# EAGLE design lm2596 current limited charger (EAGLE 9.4.2)
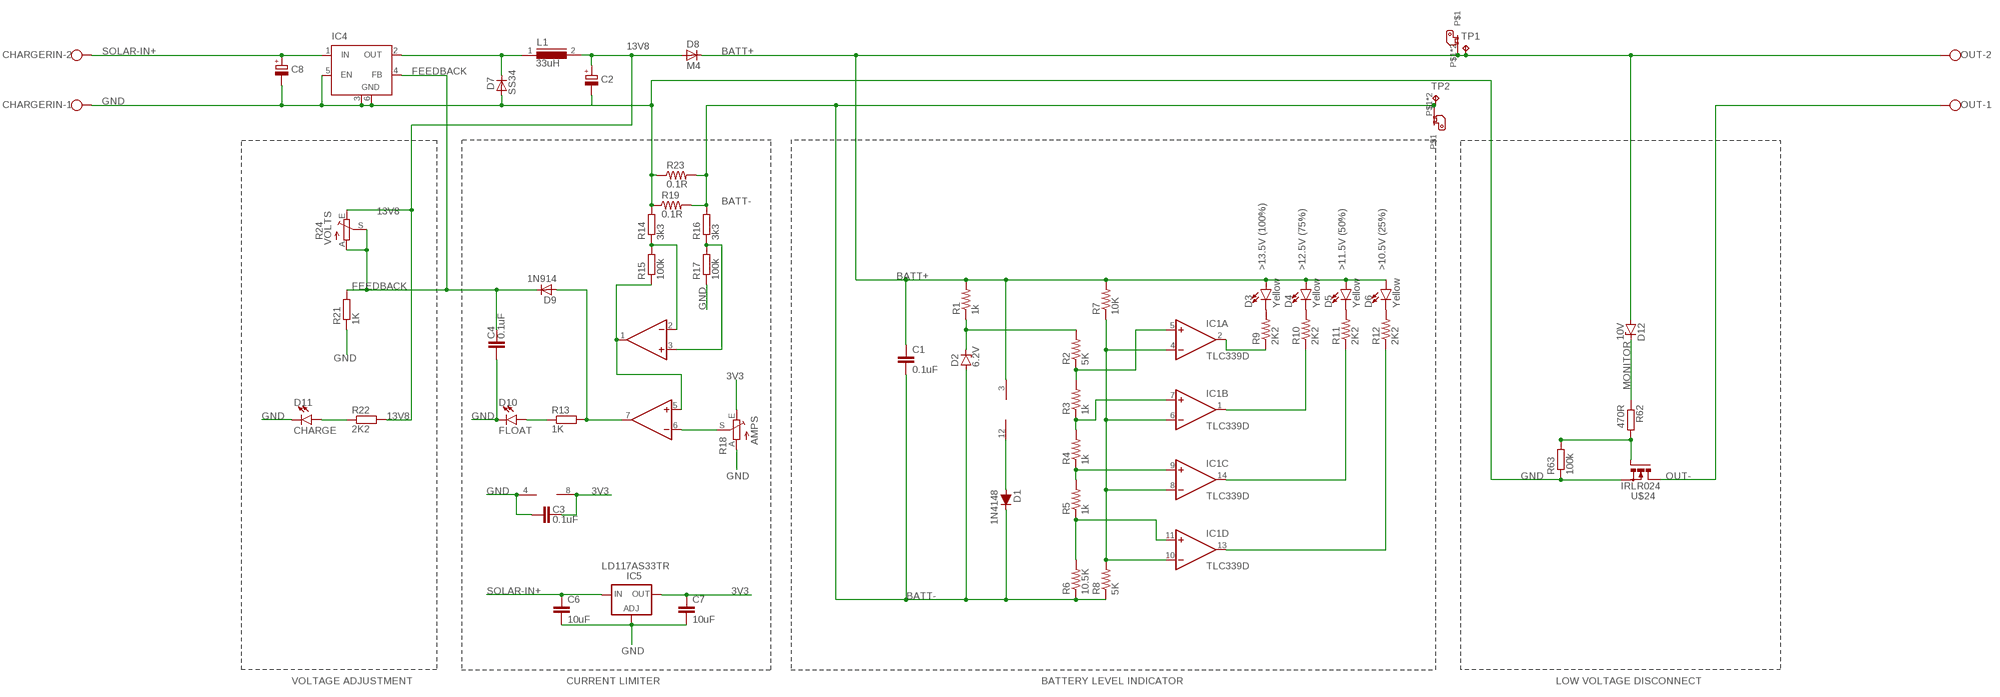
[diagram p0: schematic, sheet 1]

## Parts
C1  0.1uF  C-EUC1206K  [C1206K]
C2  CPOL-EUE3.5-8  [E3,5-8]
C3  0.1uF  C-EUC1206K  [C1206K]
C4  0.1uF  C-EUC1206K  [C1206K]
C6  10uF  C-EUC1206K  [C1206K]
C7  10uF  C-EUC1206K  [C1206K]
C8  CPOL-EUE3.5-8  [E3,5-8]
CHARGERIN  W237-102  [W237-102]
D1  1N4148  DIODE-BAS16J  [SOD-323]
D2  6.2V  ZENER-DIODESMB  [SMB]
D3  Yellow  LED-YELLOWLILYPAD  [LED-1206]
D4  Yellow  LED-YELLOWLILYPAD  [LED-1206]
D5  Yellow  LED-YELLOWLILYPAD  [LED-1206]
D6  Yellow  LED-YELLOWLILYPAD  [LED-1206]
D7  SS34  D-SOD-87  [SOD87]
D8  M4  D-SOD-87  [SOD87]
D9  1N914  D-SOD-87  [SOD87]
D10  FLOAT  LED-YELLOWLILYPAD  [LED-1206]
D11  CHARGE  LED-YELLOWLILYPAD  [LED-1206]
D12  10V  ZENER-DIODESMB  [SMB]
IC1  TLC339D  [SO14]
IC2  MCP602SN  [SO08]
IC4  LM2596S  [TO263-5]
IC5  LD117AS33TR  [SOT223]
L1  33uH  DR127  [DR127]
OUT  W237-102  [W237-102]
R1  1k  R-US_R1206  [R1206]
R2  5K  R-US_R1206  [R1206]
R3  1k  R-US_R1206  [R1206]
R4  1k  R-US_R1206  [R1206]
R5  1k  R-US_R1206  [R1206]
R6  10.5K  R-US_R1206  [R1206]
R7  10K  R-US_R1206  [R1206]
R8  5K  R-US_R1206  [R1206]
R9  2K2  R-US_R1206  [R1206]
R10  2K2  R-US_R1206  [R1206]
R11  2K2  R-US_R1206  [R1206]
R12  2K2  R-US_R1206  [R1206]
R13  1K  R-EU_R1206  [R1206]
R14  3k3  R-EU_R1206  [R1206]
R15  100k  R-EU_R1206  [R1206]
R16  3k3  R-EU_R1206  [R1206]
R17  100k  R-EU_R1206  [R1206]
R18  AMPS  TRIM_EU-B64Y  [B64Y]
R19  0.1R  R-US_R2512  [R2512]
R21  1K  R-EU_R1206  [R1206]
R22  2K2  R-EU_R1206  [R1206]
R23  0.1R  R-US_R2512  [R2512]
R24  VOLTS  TRIM_EU-B64Y  [B64Y]
R62  470R  R-EU_R0603  [R0603]
R63  100k  R-EU_R0603  [R0603]
TP1  TPPAD1-20Y  [P1-20Y]
TP2  TPPAD1-20Y  [P1-20Y]
U$2  PCB-6.35MM-RA-SPADE  [PCB-6.35MM-RA-SPADE]
U$3  PCB-6.35MM-RA-SPADE  [PCB-6.35MM-RA-SPADE]
U$24  IRLR024  N-POWER-MOSFETDPAK-MOSFET  [D-PAK_TO252AA]

## Nets
3V3: C3.2 C7.1 IC2.8(P:V+) IC5.4(OUT) R18.E
13V8: C2.+ D8.2(A) L1.2 R22.2 R24.E
BATT+: C1.1 D3.A D4.A D5.A D6.A D8.1(C) D12.A IC1.3(P:V+) OUT.2 R1.2 R7.2 TP1.TP U$2.P$1 U$2.P$2
BATT-: C1.2 D1.C D2.A R6.1 R8.1 R16.2 R19.2 R23.2 TP2.TP U$3.P$1 U$3.P$2
FEEDBACK: C4.2 D9.1(C) IC4.4(FB) R21.2 R24.A R24.S
GND: C2.- C3.1 C4.1 C6.2 C7.2 C8.- CHARGERIN.1 D7.2(A) D10.C D11.C IC2.4(P:V-) IC4.3(GND) IC4.5(EN) IC4.6(GND) IC5.1(ADJ) R14.2 R17.1 R18.A R19.1 R21.1 R23.1 R63.1 U$24.3(S)
MONITOR: D12.C R62.1
N$1: D7.1(C) IC4.2(OUT) L1.1
N$2: D2.C R1.1 R2.2
N$3: IC1.5(A:+IN) R2.1 R3.2
N$4: IC1.7(B:+IN) R3.1 R4.2
N$5: IC1.9(C:+IN) R4.1 R5.2
N$6: IC1.11(D:+IN) R5.1 R6.2
N$7: IC1.4(A:-IN) IC1.6(B:-IN) IC1.8(C:-IN) IC1.10(D:-IN) R7.1 R8.2
N$8: D3.C R9.2
N$9: D4.C R10.2
N$10: D5.C R11.2
N$11: D6.C R12.2
N$12: R62.2 R63.2 U$24.1(G)
N$13: IC1.2(A:OUT) R9.1
N$14: IC1.1(B:OUT) R10.1
N$15: IC1.14(C:OUT) R11.1
N$16: IC1.13(D:OUT) R12.1
N$17: D1.A IC1.12(P:V-)
N$18: D9.2(A) IC2.7(B:OUT) R13.2
N$19: IC2.6(B:-IN) R18.S
N$20: D10.A R13.1
N$21: IC2.1(A:OUT) IC2.5(B:+IN) R15.1
N$22: D11.A R22.1
N$23: IC2.3(A:+IN) R16.1 R17.2
N$24: IC2.2(A:-IN) R14.1 R15.2
OUT-: OUT.1 U$24.4(D)
SOLAR-IN+: C6.1 C8.+ CHARGERIN.2 IC4.1(IN) IC5.3(IN)

## Notes on the sheet
- >13.5V (100%) | >12.5V (75%) | >11.5V (50%) | >10.5V (25%)
- VOLTAGE ADJUSTMENT | CURRENT LIMITER | BATTERY LEVEL INDICATOR | LOW VOLTAGE DISCONNECT

## Library data of the parts
C1 C3 C4 C6 C7 = rcl:C-EU: CAPACITOR, European symbol; SPICEPREFIX: C
C2 C8 = resistor:CPOL-EU: POLARIZED CAPACITOR, European symbol
CHARGERIN OUT = con-wago-500:W237-102: WAGO SCREW CLAMP; MPN: 237-102; OC_FARNELL: unknown; OC_NEWARK: 70K9898
D1 = SparkFun-DiscreteSemi:DIODE: Diode These are standard reverse protection diodes and small signal diodes. SparkFun Products: SparkFun SparkPunk Sound Kit <https://www.sparkfun.com/products/11177> SparkFun ESP8266 Thing <https://www.sparkfun.com/products/13231>; PROD_ID: DIO-09646; VALUE: 250mA/100V
D2 D12 = diode:ZENER-DIODE: Z-Diode
D3-D6 = SparkFun-LED:LED-YELLOW: Yellow SMD LED Used in manufacturing several products at SparkFun. Packages: 0603 - SMD 0603 package[Product Link] <http://www.kingbrightusa.com/product.asp?catalog_name=LED&product_id=APT1608SYCK> 0603 -SMART - SMART SMD 0603 package (more efficient/more expensive) [Product Link] <http://www.osram-os.com/osram_os/en/products/product-catalog/led-light-emitting-diodes/smartled-0603/ly-l29k/index.jsp> LilyPad - SMD1206 package[Product Datasheet] <https://www.sparkfun.com/datasheets/DevTools/LilyPad/Q150YUS4.pdf> SparkFun Products: Blynk Board <https://www.sparkfun.com/products/13794> IOIO-OTG <https://www.sparkfun.com/products/13613> XBee Explorer Serial <https://www.sparkfun.com/products/13225>; PROD_ID: DIO-09909
D7-D9 = semicon-smd-ipc:D-: DIODE unfilled
D10 D11 = SparkFun-LED:LED-YELLOW: Yellow SMD LED Used in manufacturing several products at SparkFun. Packages: 0603 - SMD 0603 package[Product Link] <http://www.kingbrightusa.com/product.asp?catalog_name=LED&product_id=APT1608SYCK> 0603 -SMART - SMART SMD 0603 package (more efficient/more expensive) [Product Link] <http://www.osram-os.com/osram_os/en/products/product-catalog/led-light-emitting-diodes/smartled-0603/ly-l29k/index.jsp> LilyPad - SMD1206 package[Product Datasheet] <https://www.sparkfun.com/datasheets/DevTools/LilyPad/Q150YUS4.pdf> SparkFun Products: Blynk Board <https://www.sparkfun.com/products/13794> IOIO-OTG <https://www.sparkfun.com/products/13613> XBee Explorer Serial <https://www.sparkfun.com/products/13225>; PROD_ID: DIO-09909; VALUE: Yellow
IC1 = linear:TLC339: COMPARATOR
IC2 = linear:MCP602: Single Op Amp 2.7V to 6.0V Single Supply CMOS Source: http://ww1.microchip.com/downloads/en/DeviceDoc/21314g.pdf
IC4 = linear:LM2596S: STEP-DOWN VOLTAGE REGULATOR
IC5 = v-reg:LD117A?*: Low drop fixed and adjustable positive voltage regulators 1 A Source: http://www.st.com/stonline/products/literature/ds/7194/ld1117axx.pdf
L1 = inductors:DR127: High Power Density, High Efficiency, Shielded Inductors Source: coiltronics_dr_series.pdf
R1-R12 R19 R23 = rcl:R-US_: RESISTOR, American symbol; SPICEPREFIX: R
R13-R17 R21 R22 = rcl:R-EU_: RESISTOR, European symbol; SPICEPREFIX: R
R18 R24 = pot:TRIM_EU-: POTENTIOMETER
R62 R63 = resistor:R-EU_: RESISTOR, European symbol
TP1 TP2 = testpad:TP: Test pad
U$2 U$3 = AUTOMOTIVERELAYS:PCB-6.35MM-RA-SPADE
U$24 = Cohesion_parts:N-POWER-MOSFET

## Net classes
0 default: width 0.254 mm, clearance 0.152 mm

## Board
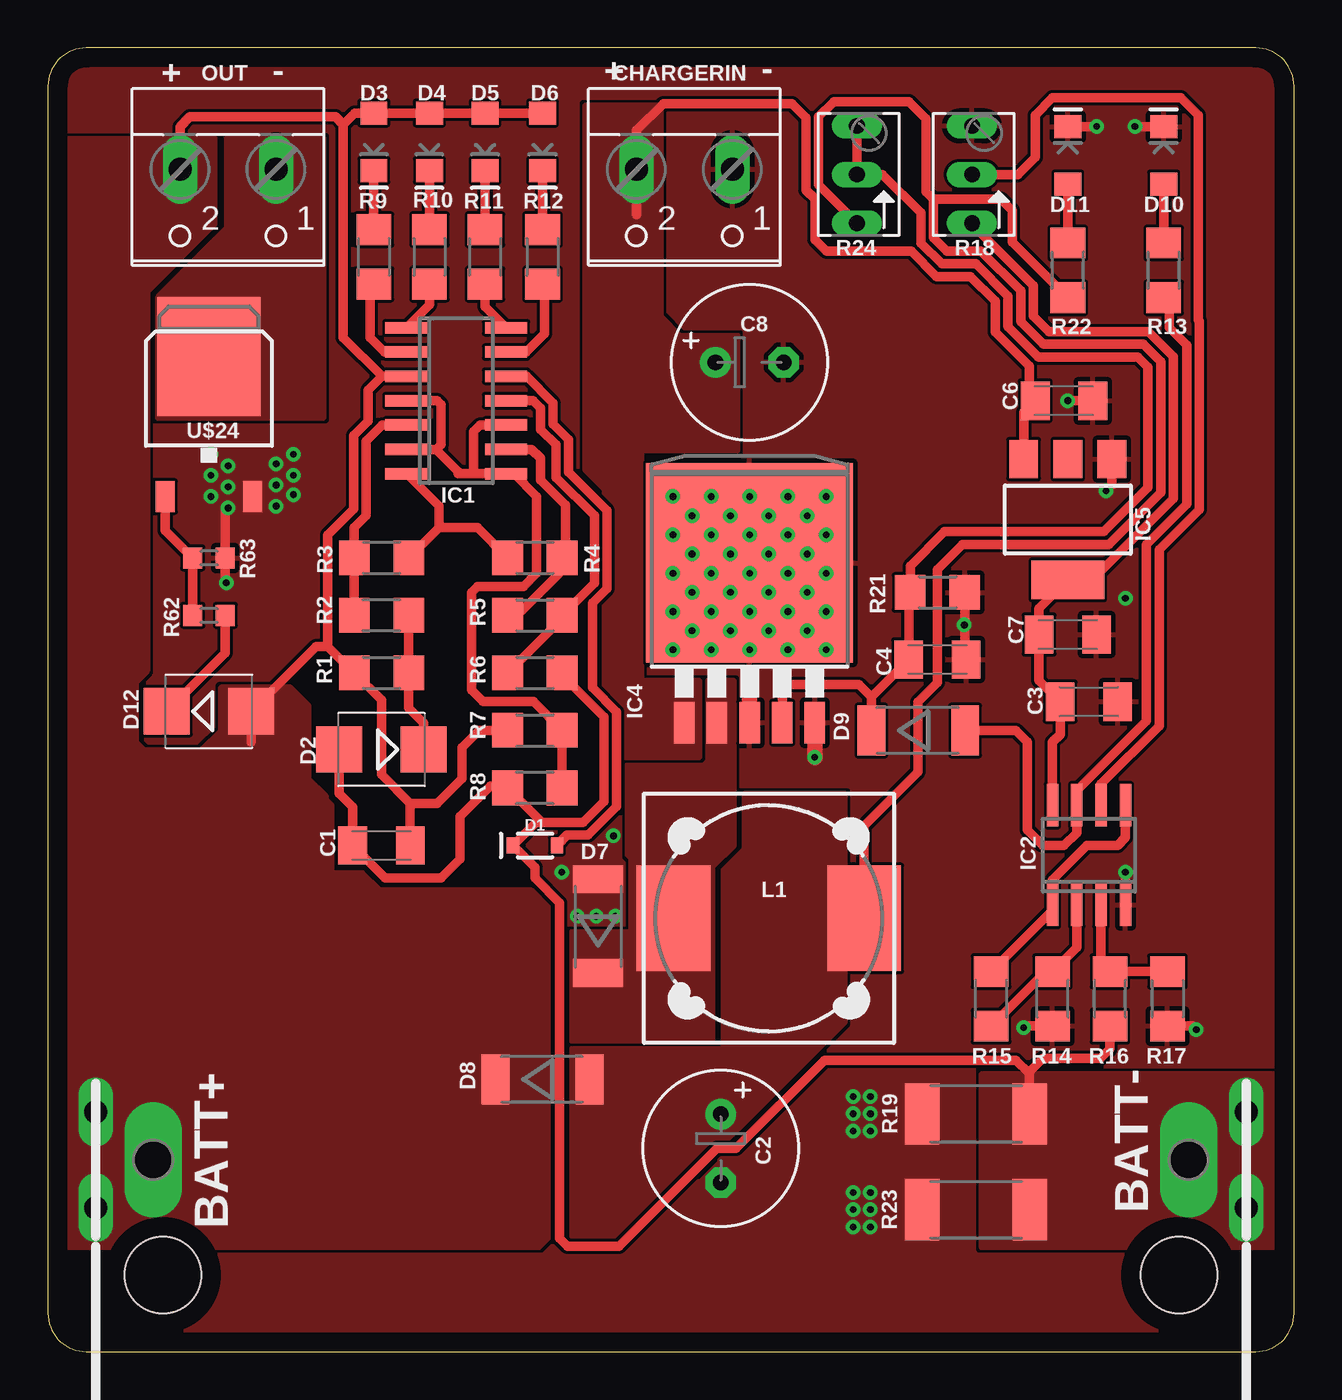
[diagram p1: board, top side]
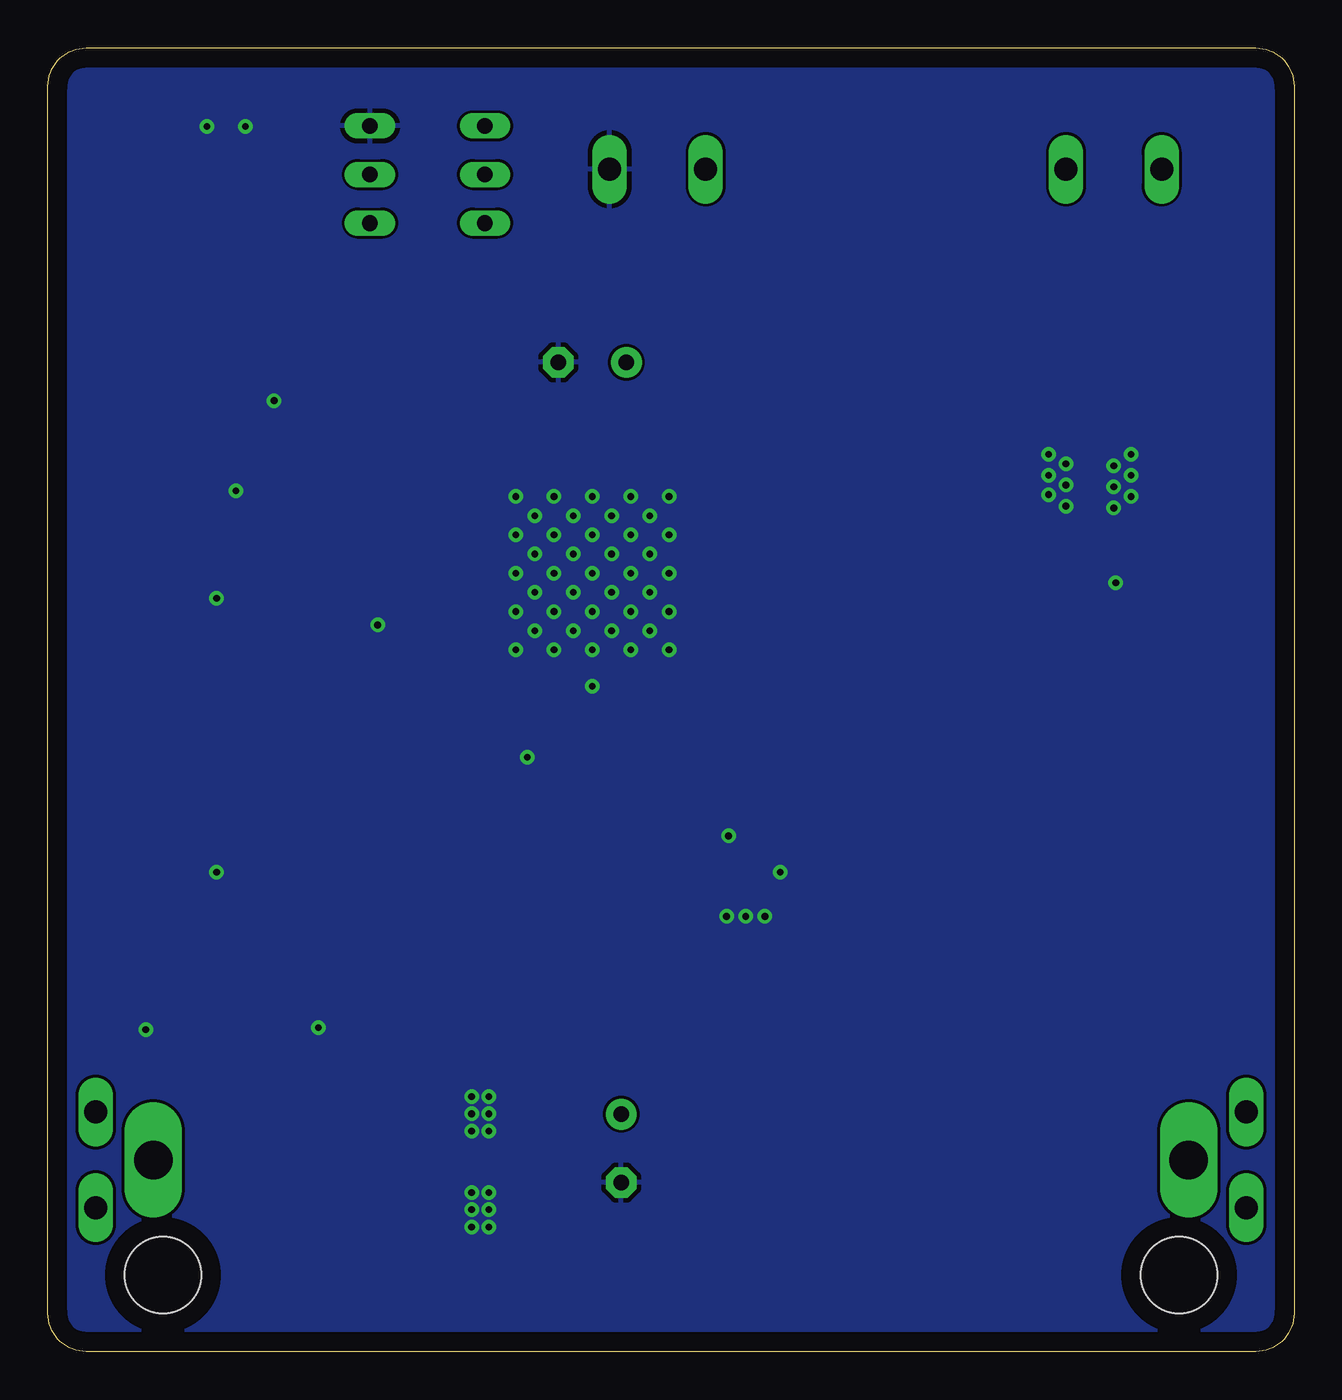
[diagram p2: board, bottom side, seen from below]

Size 65 x 68 mm. Coordinates in mm from the lower left corner, seen from the top.
Outline: 65,2 65,66 arc90 63,68 2,68 arc90 0,66 0,2 arc90 2,0 63,0 arc90 65,2
Copper layers (1*16): Top 0.035mm / dielectric 1.5mm / Bottom 0.035mm
Design rules "default": minimum track width 6mil, minimum drill 0.35mm, track to track 6mil, track to pad 6mil, pad to pad 6mil, via to via 6mil, smd to smd 6mil, copper to edge 40mil, drill to drill 6mil, minimum pad ring 10mil, minimum via ring 8mil, stop-mask expansion 4mil, vias tented up to drill 0mil, thermal gap 10mil
Holes 4 mm at 6,4 59,4

### Footprints (pad centres in the part's own frame; a part is rotated, then mirrored left to right if it is on the bottom)
C1206K = smd 1.5 x 2: 1 -1.5,0; 2 1.5,0
E3,5-8 = drill 0.813 pad 1.6: + -1.778,0 | drill 0.813 pad 1.6 octagon: - 1.778,0
W237-102 = drill 1.194 long: 1 -2.5,-1.27; 2 2.5,-1.27
SOD-323 = smd 0.63 x 0.83: A 1.15,0; C -1.15,0
SMB = smd 2.4 x 2.4: A 2.2,0; C -2.2,0
LED-1206 = smd 1.2 x 1.4: A -1.5,0; C 1.5,0
SOD87 = smd 1.45 x 2.6: 1 -2.445,0; 2 2.445,0
SO14 = smd 0.6 x 2.2: 1 -3.81,-2.6; 2 -2.54,-2.6; 3 -1.27,-2.6; 4 0,-2.6; 5 1.27,-2.6; 6 2.54,-2.6; 7 3.81,-2.6; 8 3.81,2.6; 9 2.54,2.6; 10 1.27,2.6; 11 0,2.6; 12 -1.27,2.6; 13 -2.54,2.6; 14 -3.81,2.6
SO08 = smd 0.6 x 2.2: 1 -1.905,-2.6; 2 -0.635,-2.6; 3 0.635,-2.6; 4 1.905,-2.6; 5 1.905,2.6; 6 0.635,2.6; 7 -0.635,2.6; 8 -1.905,2.6
TO263-5 = smd 1.067 x 2.159: 1 -3.404,-5.791; 2 -1.702,-5.791; 3 0,-5.791; 4 1.702,-5.791; 5 3.404,-5.791 | smd 10.8 x 10.41: 6 0,2.54
SOT223 = smd 1.5 x 2: 1 -2.3,-3.15; 2 0,-3.15; 3 2.3,-3.15 | smd 3.8 x 2: 4 0,3.15
DR127 = smd 3.85 x 5.5: 1 -4.975,0; 2 4.975,0
R1206 = smd 1.6 x 1.803: 1 -1.422,0; 2 1.422,0
B64Y = drill 0.813 long: A 2.54,0; E -2.54,0; S 0,0
R2512 = smd 1.8 x 3.2: 1 -2.8,0; 2 2.8,0
R0603 = smd 1 x 1.1: 1 -0.85,0; 2 0.85,0
P1-20Y = drill 2.007 pad 2.54 long: TP 0,0
PCB-6.35MM-RA-SPADE = drill 1.2 long: P$1 0,2.5; P$2 0,-2.5
D-PAK_TO252AA = smd 1 x 1.6: 1 -2.28,-4.8; 3 2.28,-4.8 | smd 5.4 x 6.2: 4 0,2.5

### Placement (x,y rotation side)
C1  17.4,26.4 180 top
C2  35.1,10.6 270 top
C3  54.3,33.9 180 top
C4  46.4,36.1 180 top
C6  53,49.6 0 top
C7  53.2,37.4 0 top
C8  36.6,51.6 0 top
CHARGERIN  33.2,60.4 180 top
D1  25.4,26.4 0 top
D2  17.4,31.4 180 top
D3  17,63.1 270 top
D4  19.9,63.1 270 top
D5  22.8,63.1 270 top
D6  25.8,63.1 270 top
D7  28.7,22.2 90 top
D8  25.8,14.2 0 top
D9  45.4,32.4 0 top
D10  58.2,62.4 90 top
D11  53.2,62.4 90 top
D12  8.4,33.4 0 top
IC1  21.3,49.6 270 top
IC2  54.3,25.9 0 top
IC4  36.6,38.6 0 top
IC5  53.2,43.4 180 top
L1  37.6,22.6 0 top
OUT  9.4,60.4 180 top
R1  17.4,35.4 180 top
R2  17.4,38.4 0 top
R3  17.4,41.4 180 top
R4  25.4,41.4 180 top
R5  25.4,38.4 180 top
R6  25.4,35.4 180 top
R7  25.4,32.4 180 top
R8  25.4,29.4 0 top
R9  17,57.1 90 top
R10  19.9,57.1 90 top
R11  22.8,57.1 90 top
R12  25.8,57.1 90 top
R13  58.2,56.4 270 top
R14  52.4,18.4 270 top
R15  49.2,18.4 270 top
R16  55.4,18.4 270 top
R17  58.4,18.4 90 top
R18  48.2,61.4 90 top
R19  48.4,12.4 0 top
R21  46.4,39.6 180 top
R22  53.2,56.4 270 top
R23  48.4,7.4 0 top
R24  42.2,61.4 90 top
R62  8.4,38.4 180 top
R63  8.4,41.4 180 top
TP1  5.5,10 180 top
TP2  59.5,10 180 top
U$2  2.5,10 180 top
U$3  62.5,10 180 top
U$24  8.4,49.4 0 top

### Tracks (layer width: path | path; a pad name or v marks a point on that pad's centre or on a via)
3V3
  Top 0.508: IC2.8 52.4,31.8 52.8,32.2 C3.2 51.7,35 C7.1 51.7,38.75 IC5.4 54.45,40.25 58.7,44.5 58.7,51.9 57.4,53.2 52.2,53.2 51.4,54 51.4,55.6 48.2,58.8 R18.E
13V8
  Top 0.508: R22.2 50.3,57.88 50.3,59.5 49.7,60.1 46.2,60.1 | R24.E 40.2,60.86 40.2,64.4 41,65.2 44.9,65.2 45.8,64.3 45.8,60.5 46.2,60.1 | L1.2 42.58,27.42 45.39,30.23 45.39,33.89 46.4,34.9 46.4,40.8 47.7,42.1 55.34,42.1 58.04,44.8 58.04,51.63 57.13,52.54 51.93,52.54 50.74,53.73 50.74,55.33 48.67,57.4 46.9,57.4 46.2,58.1 46.2,60.1
  pour Top (no thermals): 36.3,29.1 36.3,26.2 35.2,25.1 35.2,15.8 27.3,15.8 27.3,6 30.4,6 41.6,17.2 41.6,29.1
BATT+
  Top 0.508: D6.A D5.A D4.A D3.A 16,64.6 15.4,64 | IC1.3 17.43,50.87 | 17.43,50.87 15.4,52.9 15.4,64 | 14.6,36.78 R1.2 17.4,33.98 17.4,30.1 18.9,28.6 | 17.43,50.87 16.7,50.14 16.7,48.53 15.94,47.77 15.94,43.94 14.6,42.6 14.6,36.78 | 18.9,28.6 C1.1 | R7.2 22.5,32.4 21.6,31.5 21.6,29.9 20.3,28.6 18.9,28.6 | OUT.2 6.9,63.9 7.4,64.4 15,64.4 15.4,64 | 14.6,36.78 13.98,36.78 D12.A 10.6,31.8
  pour Top (rank 2, no thermals): 8.7,63.3 8.7,58.8 5.2,55.3 5.2,35.5 4.6,34.9 4.6,31.8 5,31.4 8,31.4 9,32.4 9,34.6 9.1,34.7 12.6,34.7 13.6,33.7 13.6,29.9 14.5,29 14.5,28.8 14.8,28.5 14.8,25 16.4,25 17.3,24.1 25.2,24.1 26.1,23.2 26.1,5.9 25.6,5.4 0.7,5.4 0.3,5.8 0.3,63.3
BATT-
  Top 0.508: D2.A 15.2,29.1 15.9,28.4 C1.2 17.6,24.7 20.5,24.7 21.5,25.7 21.5,27.9 23.1,29.5 23.88,29.5 R8.1 25.78,27.6 | 25.78,27.6 27.9,27.6 29,28.7 29,33.1 26.82,35.28 R6.1 | 25.78,27.6 25.45,27.6 D1.C 25.4,25.25 25.4,24.7 26.7,23.4 26.7,5.9 27.1,5.5 29.8,5.5 34.9,10.6 35.9,10.6 40.5,15.2 50.5,15.2 51.2,14.5 | R19.2 51.2,14.5 | R16.2 55.4,15.8 54.9,15.3 51.9,15.3 51.2,14.6 51.2,14.5
  pour Top (rank 2, no thermals): 48.7,5.4 48.7,14.5 64.7,14.5 64.7,5.4
FEEDBACK
  Top 0.508: R24.A R24.S 43.54,61.4 45.54,59.4 45.54,57.83 46.63,56.74 48.39,56.74 50.08,55.05 50.08,53.45 51.65,51.88 56.85,51.88 57.38,51.35 57.38,45.07 55.07,42.76 46.76,42.76 44.98,40.98 R21.2 44.9,39.52 C4.2 42.95,34.15 | IC4.4 38.3,34.5 38.6,34.8 42.3,34.8 42.95,34.15 | 42.95,34.15 D9.1
GND  (via drill 0.35)
  Top 0.508: D10.C v56.7,63.9 | D11.C v54.7,63.9 | 55.8,46.85 IC5.1 55.5,45.2 v55.2,44.9 | C6.2 v53.2,49.6 | R14.2 50.98,16.98 v50.9,16.9 | R17.1 59.72,16.98 v59.9,16.8 | IC2.4 v56.2,25 | R21.1 47.82,37.92 | 47.82,37.92 v47.8,37.9 | C4.1 47.82,36.18 47.82,37.92 | v9.4,44 9.25,43.85 R63.1 9.25,40.15 v9.3,40.1 | C7.2 54.7,36.9
  Top 0.813: IC4.3 v36.6,34.7 | IC4.5 v40,31
  other vias: 42,13.3 42.9,13.3 42,12.4 42.9,12.4 42,11.5 42.9,11.5 42,8.3 42.9,8.3 42,7.4 42.9,7.4 42,6.5 42.9,6.5 26.8,25 27.6,22.7 28.6,22.7 29.6,22.7 29.5,26.9 11.9,44.1 11.9,45.2 11.9,46.3 12.8,45.7 12.8,44.7 9.4,45.1 9.4,46.2 8.5,45.7 8.5,44.6 12.8,46.8 8.5,46.8 56.2,39.3 36.6,38.6 36.6,40.6 36.6,42.6 36.6,44.6 36.6,36.6 37.6,37.6 37.6,39.6 37.6,41.6 37.6,43.6 35.6,43.6 35.6,41.6 35.6,39.6 35.6,37.6 34.6,36.6 34.6,38.6 34.6,40.6 34.6,42.6 34.6,44.6 38.6,44.6 38.6,42.6 38.6,40.6 38.6,38.6 38.6,36.6 39.6,37.6 39.6,39.6 39.6,41.6 39.6,43.6 40.6,44.6 40.6,42.6 40.6,40.6 40.6,38.6 40.6,36.6 33.6,37.6 32.6,36.6 32.6,38.6 33.6,39.6 32.6,40.6 33.6,41.6 33.6,43.6 32.6,44.6 32.6,42.6
  pour Top (no thermals): 48.2,5.4 48.2,14.5 40.6,14.5 36.2,10.1 35.3,10.1 30.6,5.4
  pour Top (no thermals): 29.8,27.4 29.8,25.7 30,25.5 30,22.3 27.3,22.3 27.3,23.7 26,25 26,25.5 26.1,25.6 26.2,25.7 27,25.7 27.2,25.9 27.2,26.1 27.4,26.3 27.8,26.3 28.4,26.3 28.8,26.7 29.5,27.4
  pour Top (no thermals): 7.9,47.3 7.9,44.3 8.7,43.5 12.5,43.5 13.4,44.4 13.4,47.3
  pour Top (rank 6): 65,-0.2 65,67.9 0,67.9 0,0.3 0.5,-0.2
  pour Bottom (rank 6): 65.1,0 65.1,68.1 0.1,68.1 0.1,0.5 0.6,0
MONITOR
  Top 0.508: D12.C 9.25,36.45 R62.1
N$1
  pour Top (rank 2, no thermals): 34.4,35 34.4,30.8 34.2,30.6 30.2,30.6 30.2,25.9 30.4,25.7 30.4,23.5 30.4,21.9 27.3,21.9 27.3,16.2 34.7,16.2 34.7,25.3 35.8,26.4 35.8,35
N$2
  Top 0.508: R2.2 R1.1 18.82,33.58 19.6,32.8 D2.C
N$3
  Top 0.508: IC1.5 17.43,48.33 16.6,47.5 16.6,43.6 15.98,42.98 R3.2 R2.1
N$4
  Top 0.508: 20.4,42.98 R3.1 | IC1.7 20.4,44.09 20.4,42.98 | R4.2 22.4,42.98 20.4,42.98
N$5
  Top 0.508: IC1.9 25.24,47.06 25.7,46.6 25.7,45.47 27,44.17 27,41.58 R4.1 26.82,40.74 24.48,38.4 R5.2
N$6
  Top 0.508: IC1.11 25.3,49.6 25.7,49.2 25.7,48.1 26.5,47.3 26.5,45.6 28.5,43.6 28.5,40.08 R5.1 26.82,38.24 R6.2
N$7
  Top 0.508: IC1.6 20.24,47.06 | 22.3,45.8 21.4,45.8 21.4,45.9 20.24,47.06 | 22.3,45.8 IC1.8 24.31,45.79 25.5,44.6 25.5,40.6 24.8,39.9 22.4,39.9 22.1,39.6 22.1,34.5 22.7,33.9 25.32,33.9 R7.1 R8.2 | IC1.10 22.53,48.33 22.2,48 22.2,45.9 22.3,45.8 | 20.24,47.06 20.5,47.32 20.5,49.4 20.3,49.6 IC1.4
N$8
  Top 0.508: R9.2 D3.C
N$9
  Top 0.508: R10.2 D4.C
N$10
  Top 0.508: R11.2 D5.C
N$11
  Top 0.508: R12.2 D6.C
N$12
  Top 0.508: R62.2 R63.2 6.12,42.83 U$24.1
N$13
  Top 0.508: IC1.2 17.56,52.14 16.8,52.9 16.8,55.48 R9.1
N$14
  Top 0.508: IC1.1 19.9,54.61 R10.1
N$15
  Top 0.508: IC1.14 22.8,54.51 R11.1
N$16
  Top 0.508: IC1.13 24.94,52.14 25.9,53.1 25.9,55.58 R12.1
N$17
  Top 0.508: D1.A 27.09,26.94 28.17,26.94 29.66,28.43 29.66,33.37 28.4,34.63 28.4,39.04 29.16,39.8 29.16,43.87 27.16,45.87 27.16,47.57 26.36,48.37 26.36,49.47 24.96,50.87 IC1.12
N$18
  Top 0.508: D9.2 50.5,32.4 51.1,31.8 51.1,27.2 51.9,26.4 53,26.4 53.66,27.06 IC2.7 53.66,29.27 57.3,32.9 57.3,42.1 59.4,44.2 59.4,52.5 58.5,53.4 58.5,54.68 R13.2
N$19
  Top 0.508: IC2.6 54.94,29.6 57.96,32.63 57.96,41.83 60.06,43.93 60.06,53.74 60,53.8 60,64.5 59.1,65.4 52.4,65.4 51.5,64.5 51.5,62.3 50.6,61.4 R18.S
N$20
  Top 0.508: R13.1 D10.A
N$21
  Top 0.508: IC2.5 56.2,26.8 55.8,26.4 54.2,26.4 52.4,24.59 IC2.1 52.4,23.02 R15.1
N$22
  Top 0.508: R22.1 D11.A
N$23
  Top 0.508: IC2.3 54.94,20.29 R16.1 R17.2
N$24
  Top 0.508: R15.2 52.04,19.82 R14.1 53.66,21.09 IC2.2
OUT-
  pour Top (no thermals): 9.3,63.3 9.3,58.6 5.7,55 5.7,48.7 14.4,48.7 14.4,63.3
SOLAR-IN+
  Top 0.508: IC5.3 50.9,49 C6.1 51.2,49.9 51.2,51.4 49.42,53.18 49.42,54.78 48.12,56.08 46.35,56.08 45.03,57.4 40.6,57.4 40,58 40,60.13 39.54,60.59 39.54,64.36 38.8,65.1 32.1,65.1 30.7,63.7 CHARGERIN.2 30.7,61.2 30.7,59.3
  pour Top (no thermals): 28,65 28,46 29,45 29,32 30,31 34,31 34,35 31,35 31,47 36,47 36,53 33,53 32,54 32,65

### Text on the board
tPlace: + | - | + | - | BATT+ | BATT-